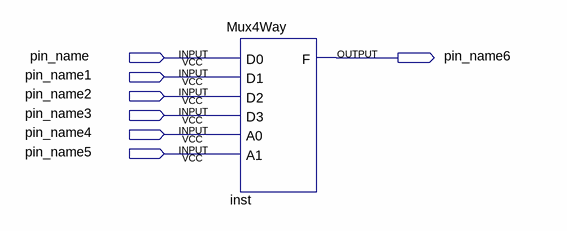
[diagram p0: schematic sheet]
// Quartus schematic Chapter4-1.bdf as structural Verilog: 1 symbols, 7 pins
module \Chapter4-1  (
  input  pin_name,
  input  pin_name1,
  input  pin_name2,
  input  pin_name3,
  input  pin_name4,
  input  pin_name5,
  output pin_name6
);

  Mux4Way inst (
    .D0(pin_name), .D1(pin_name1), .D2(pin_name2), .D3(pin_name3), .A0(pin_name4), .A1(pin_name5),
    .F(pin_name6));
endmodule
